# EAGLE design weatherMat (EAGLE 7.5.0)
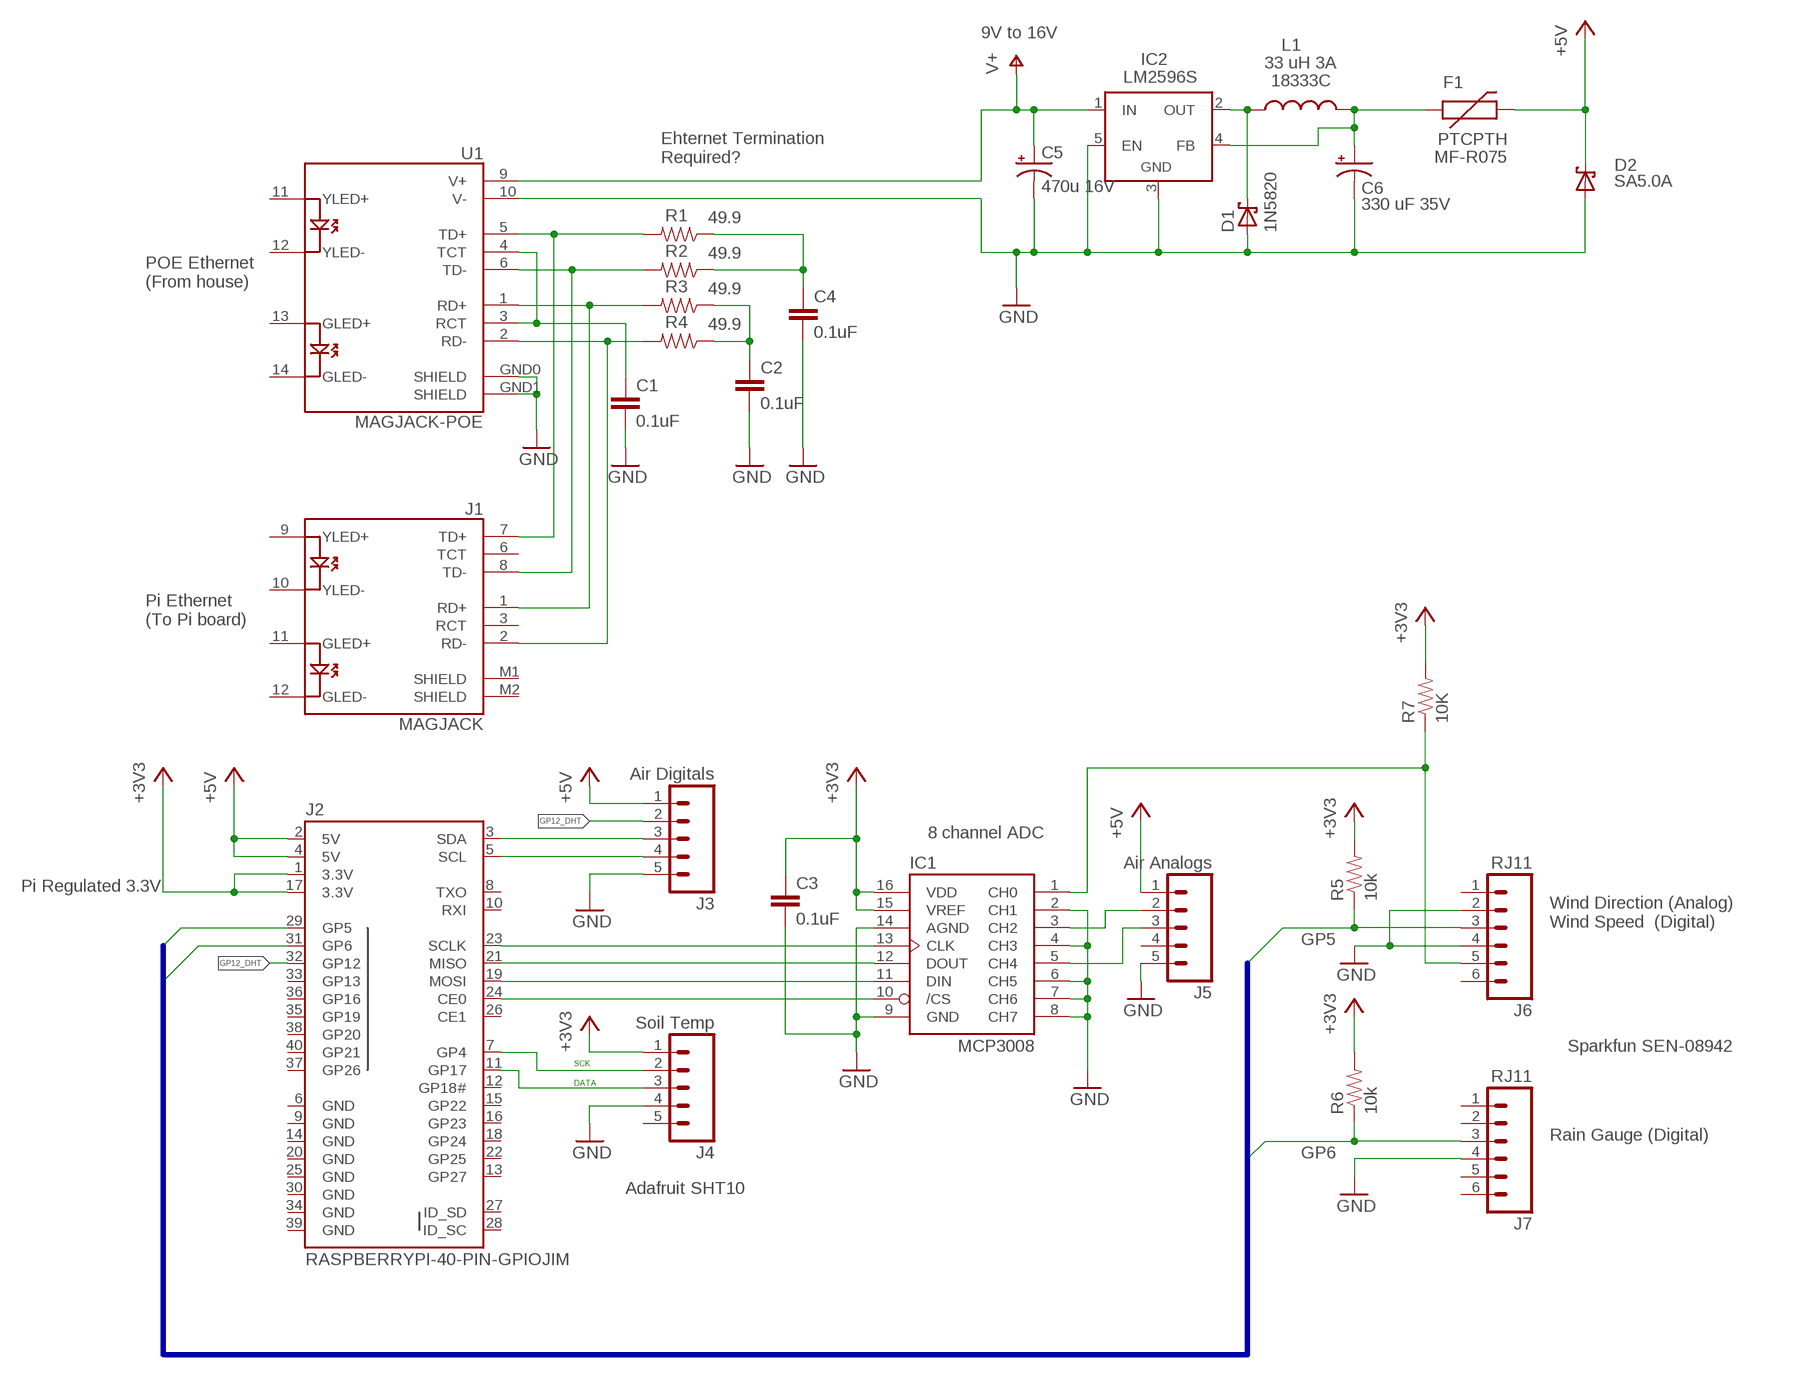
[diagram p0: schematic, sheet 1]

## Parts
C1  0.1uF  CAPPTH  [CAP-PTH-SMALL]
C2  0.1uF  CAPPTH  [CAP-PTH-SMALL]
C3  0.1uF  CAPPTH  [CAP-PTH-SMALL]
C4  0.1uF  CAPPTH  [CAP-PTH-SMALL]
C5  470u 16V  CAP_POL  [CPOL-RADIAL-470UF-16V]
C6  330 uF 35V  CAP_POLTEST  [CPOL-RADIAL-100UF-25V]
D1  1N5820  SCHOTTKY-DIODEDO201T15  [DO201T15]
D2  SA5.0A  [DO15-12]
F1  PTCPTH  [PTC]
IC1  MCP3008  [DIL16]
IC2  LM2596S  LM2596TV  [TO220-51]
J1  MAGJACK  [MAGJACK]
J2  RASPBERRYPI-40-PIN-GPIOJIM  [2X20-JIM]
J3  Air Digitals  M05SCREW  [SCREWTERMINAL-3.5MM-5]
J4  Soil Temp  M05SCREW  [SCREWTERMINAL-3.5MM-5]
J5  Air Analogs  M05SCREW  [SCREWTERMINAL-3.5MM-5]
J6  RJ11  RJ11-6PTH  [RJ11-6]
J7  RJ11  RJ11-6PTH  [RJ11-6]
L1  33 uH 3A  INDUCTORMUR  [MURATA]
R1  49.9  RESISTORPTH-1/4W  [AXIAL-0.4]
R2  49.9  RESISTORPTH-1/4W  [AXIAL-0.4]
R3  49.9  RESISTORPTH-1/4W  [AXIAL-0.4]
R4  49.9  RESISTORPTH-1/4W  [AXIAL-0.4]
R5  10k  RESISTORPTH-1/4W  [AXIAL-0.4]
R6  10k  RESISTORPTH-1/4W  [AXIAL-0.4]
R7  10K  RESISTORPTH-1/4W  [AXIAL-0.4]
U1  MAGJACK-POE  [MAGJACK-POE]

## Nets
+3V3 [power]: C3.1 IC1.15(VREF) IC1.16(VDD) J2.1(3.3V) J2.17(3.3V) J4.1 R5.P$2 R6.P$2 R7.P$2
+5V [power]: D2.C F1.P$2 J2.2(5V) J2.4(5V) J3.1 J5.1
GND [power]: C1.2 C2.2 C3.2 C4.2 C5.2(-) C6.2(-) D1.A D2.A IC1.2(CH1) IC1.4(CH3) IC1.6(CH5) IC1.7(CH6) IC1.8(CH7) IC1.9(GND) IC1.14(AGND) IC2.3(GND) IC2.5(EN) J3.5 J4.4 J5.5 J6.2 J6.4 J7.4 U1.10(V-) U1.GND0(SHIELD) U1.GND1(SHIELD)
GP5: J2.29(GP5) J6.3 R5.P$1
GP6: J2.31(GP6) J7.3 R6.P$1
GP12_DHT: J2.32(GP12) J3.2
N$1 [power]: D1.C IC2.2(OUT) L1.P$1
N$2: C1.1 U1.3(RCT) U1.4(TCT)
N$3: J1.7(TD+) R1.P$2 U1.5(TD+)
N$4: J1.8(TD-) R2.P$2 U1.6(TD-)
N$5: J1.1(RD+) R3.P$2 U1.1(RD+)
N$6: J1.2(RD-) R4.P$2 U1.2(RD-)
N$7: C4.1 R1.P$1 R2.P$1
N$8: C2.1 R3.P$1 R4.P$1
N$9: IC1.12(DOUT) J2.21(MISO)
N$10: IC1.11(DIN) J2.19(MOSI)
N$11: IC1.13(CLK) J2.23(SCLK)
N$12: IC1.10(/CS) J2.24(CE0)
N$13: IC1.1(CH0) J6.5 R7.P$1
N$14 [power]: C6.1(+) F1.P$1 IC2.4(FB) L1.P$3
N$15: J2.3(SDA) J3.3
N$16: J2.5(SCL) J3.4
N$17: IC1.3(CH2) J5.2
N$18: IC1.5(CH4) J5.3
N$20: J2.11(GP17) J4.3
N$21: J2.7(GP4) J4.2
V+ [power]: C5.1(+) IC2.1(IN) U1.9(V+)
Unconnected: J1.3(RCT) J1.6(TCT) J1.9(YLED+) J1.10(YLED-) J1.11(GLED+) J1.12(GLED-) J1.M1(SHIELD) J1.M2(SHIELD) J2.8(TXO) J2.10(RXI) J2.12(GP18#) J2.13(GP27) J2.15(GP22) J2.16(GP23) J2.18(GP24) J2.22(GP25) J2.26(CE1) J2.27(ID_SD) J2.28(ID_SC) J2.33(GP13) J2.35(GP19) J2.36(GP16) J2.37(GP26) J2.38(GP20) J2.40(GP21) J4.5 J5.4 J6.1 J6.6 J7.1 J7.2 J7.5 J7.6 U1.11(YLED+) U1.12(YLED-) U1.13(GLED+) U1.14(GLED-)

## Buses
GPBUS:GP5,GP6

## Notes on the sheet
- 9V to 16V
- Ehternet Termination
  Required?
- POE Ethernet
  (From house)
- Pi Ethernet
  (To Pi board)
- 8 channel ADC
- Pi Regulated 3.3V
- Wind Direction (Analog)
  Wind Speed  (Digital)
- Sparkfun SEN-08942
- SCK
- DATA
- Rain Gauge (Digital)
- Adafruit SHT10

## Power pins joined to a net without a drawn wire
GND: J2.6(GND) J2.9(GND) J2.14(GND) J2.20(GND) J2.25(GND) J2.30(GND) J2.34(GND) J2.39(GND)

## Library data of the parts
C1-C4 = SparkFun-Capacitors:CAP: Capacitor Standard 0603 ceramic capacitor, and 0.1" leaded capacitor.
C5 C6 = SparkFun-Capacitors:CAP_POL: Capacitor Polarized These are standard SMD and PTH capacitors. Normally 10uF, 47uF, and 100uF in electrolytic and tantalum varieties. Always verify the external diameter of the through hole cap, it varies with capacity, voltage, and manufacturer. The EIA devices should be standard.
D1 = adafruit:SCHOTTKY-DIODE: Schottky Diode
D2 = diode:SA5.0A: DIODE transient voltage suppressor
F1 = SparkFun-PowerIC:PTC: Resettable Fuse PTC Resettable Fuse. Spark Fun Electronics SKU : COM-08357; PARTNUM: MF-R075
IC1 = adafruit:MCP3008
IC2 = linear:LM2596T: STEP-DOWN VOLTAGE REGULATOR
J1 = SparkFun-Connectors:MAGJACK: RJ-45 with LEDs
J2 = SparkFun-Boards:RASPBERRYPI-40-PIN-GPIO: Second Generation Raspberry Pi GPIO Header 2x20 pin connector, as found on B, B+, A+ models.
J3-J5 = SparkFun-Connectors:M05: Header 5 Standard 5-pin 0.1" header. Use with straight break away headers (SKU : PRT-00116), right angle break away headers (PRT-00553), swiss pins (PRT-00743), machine pins (PRT-00117), and female headers (PRT-00115). Molex polarized connector foot print use with SKU : PRT-08230 with associated crimp pins and housings.; PROD_ID: Combine 8288+8399
J6 J7 = SparkFun-Connectors:RJ11-6: RJ11 Jack Simple 6 pin RJ11 jack. Commonly found on CAT3 devices and Microchip programmers. SKU: PRT-00132; PROD_ID: CONN-08590
L1 = SparkFun-Passives:INDUCTOR: Inductors Basic Inductor/Choke - 0603 and 1206. Footprints are not proven and vary greatly between part numbers. INDUCTOR POWER 3.3UH 4.0A SMD 0.197" L x 0.197" W x 0.177" H (5.00mm x 5.00mm x 4.50mm); PARTNUM: 18333C
R1-R7 = SparkFun-Passives:RESISTOR: Resistor Basic schematic elements and footprints for 0603, 1206, and PTH resistors.
U1 = SparkFun-Connectors:MAGJACK-POE: PoE compatible MagJack

## Net classes
0 default: width 0.305 mm, clearance 0.205 mm
1 power: width 1.016 mm, clearance 0.205 mm

## Board
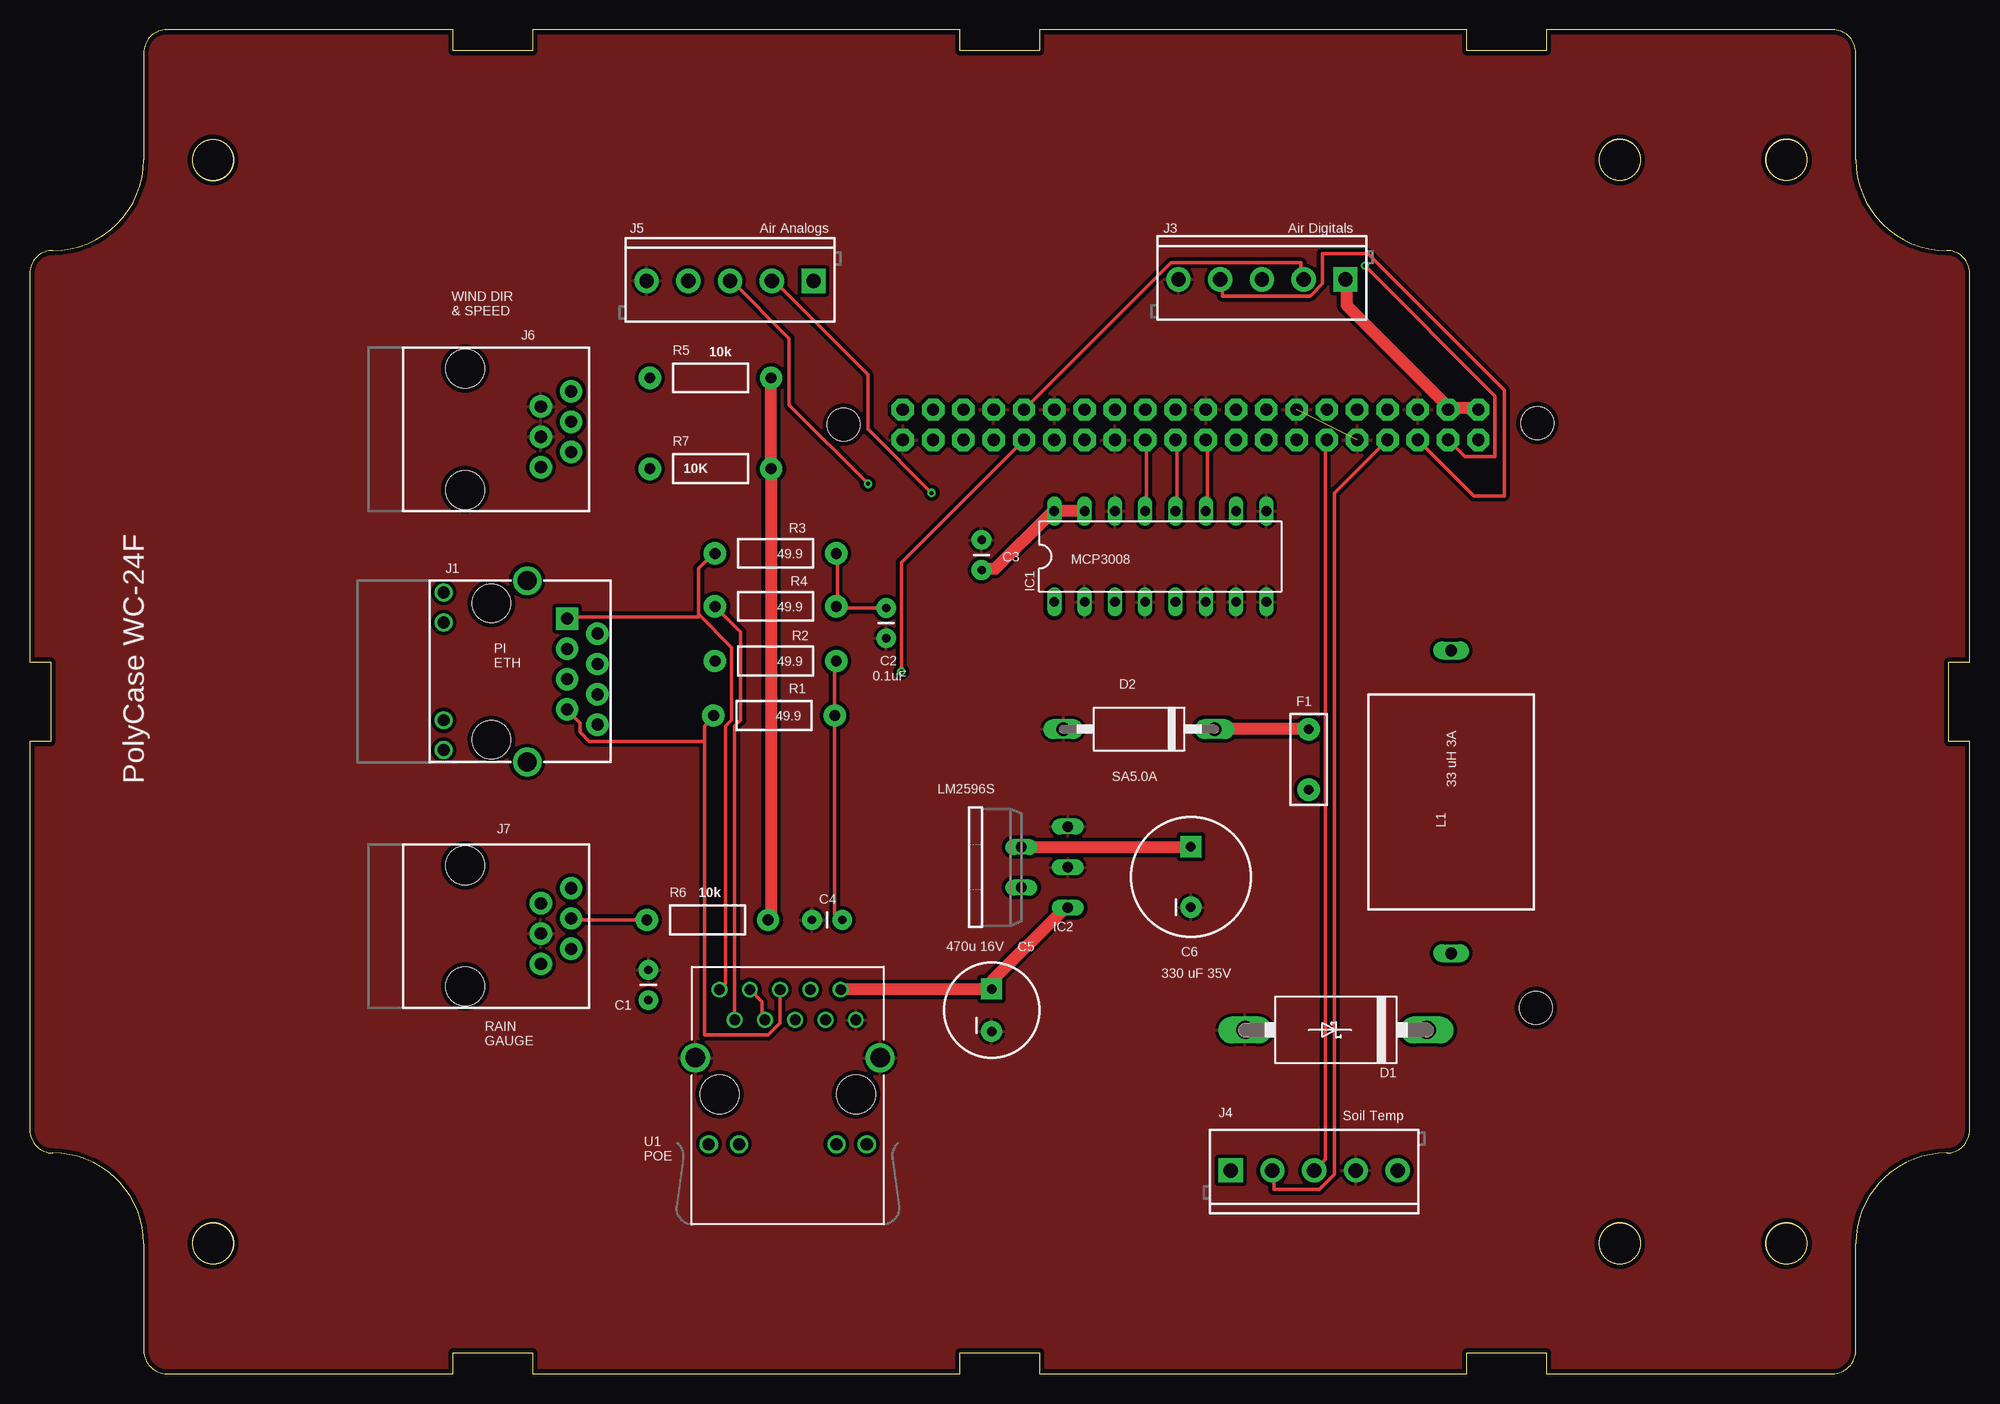
[diagram p1: board, top side]
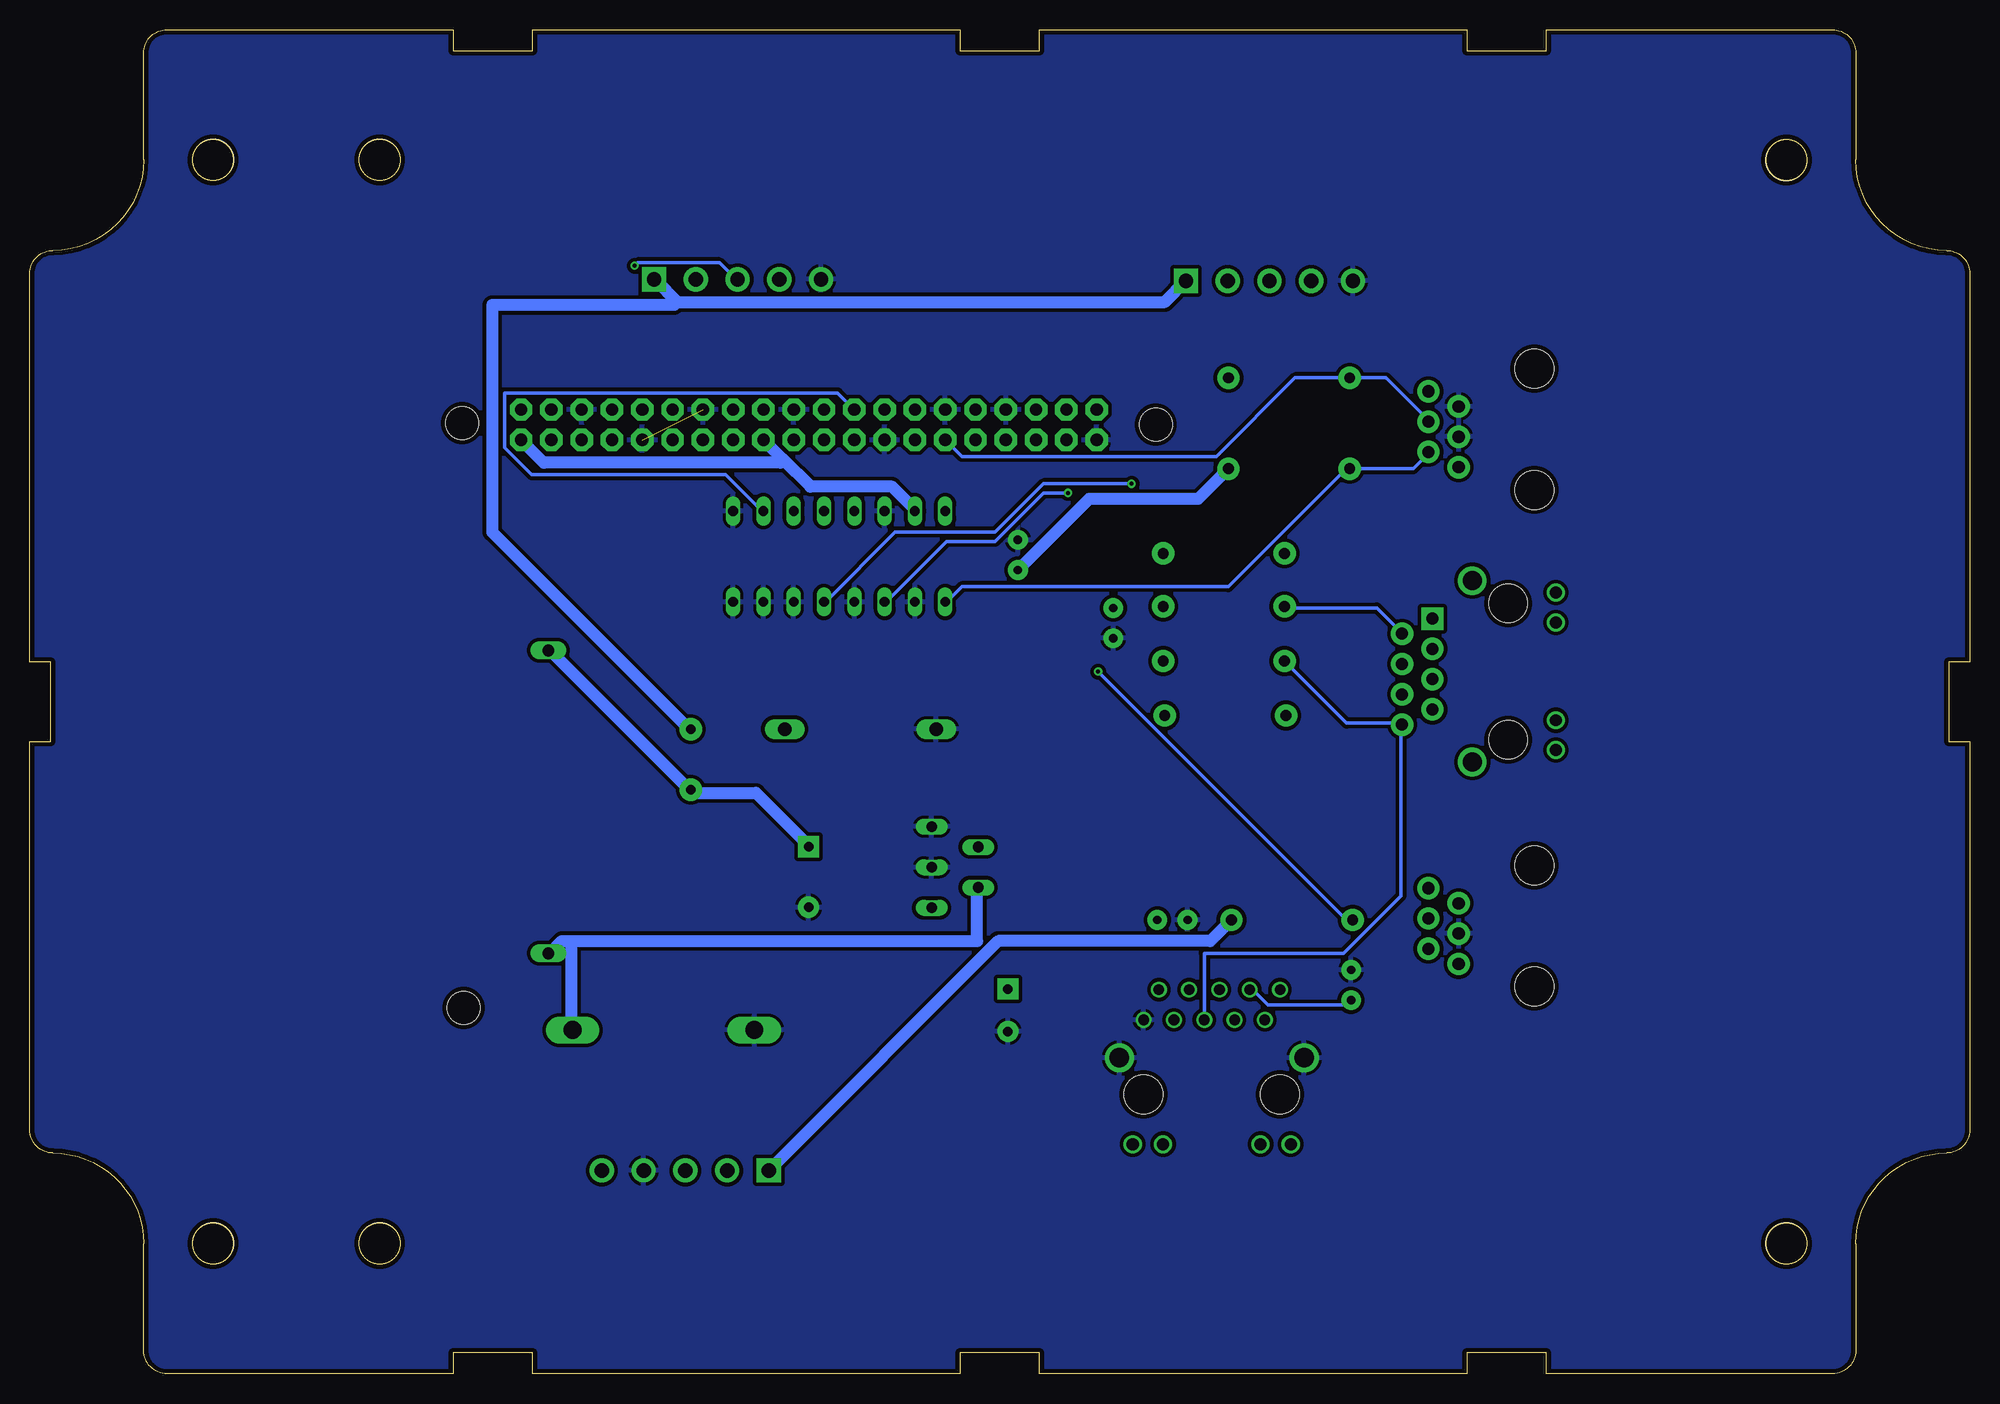
[diagram p2: board, bottom side, seen from below]

Size 162.66 x 112.7 mm. Coordinates in mm from the lower left corner, seen from the top.
Copper layers (1*16): Top 0.0356mm / dielectric 1.5011mm / Bottom 0.0356mm
Design rules "LaenPCBOrder": minimum track width 6mil, minimum drill 13mil, track to track 6mil, track to pad 6mil, pad to pad 6mil, via to via 6mil, smd to smd 6mil, copper to edge 15mil, drill to drill 6mil, minimum pad ring 7mil, minimum via ring 7mil, stop-mask expansion 3mil, vias tented up to drill 0mil, thermal gap 10mil
Holes 2.75 mm at 126.42,79.71 126.29,30.68 68.25,79.58
Holes 3.43 mm at 133.32,101.8 147.29,101.8 147.29,10.92 133.32,10.92 15.37,10.92 15.37,101.78

### Footprints (pad centres in the part's own frame; a part is rotated, then mirrored left to right if it is on the bottom)
CAP-PTH-SMALL = drill 0.7 pad 1.651: 1 0,0; 2 2.54,0
CPOL-RADIAL-470UF-16V = drill 0.8 pad 1.778 square: 1 1.778,0 | drill 0.8 pad 1.778: 2 -1.778,0
CPOL-RADIAL-100UF-25V = drill 0.8 pad 1.778 square: 1 2.54,0 | drill 0.8 pad 1.778: 2 -2.54,0
DO201T15 = drill 1.499 long: A 7.62,0; C -7.62,0
DO15-12 = drill 1.118 long: A 6.35,0; C -6.35,0
PTC = drill 0.8 pad 1.88: P$1 -2.54,0; P$2 2.54,0
DIL16 = drill 0.813 long: 1 -8.89,-3.81; 2 -6.35,-3.81; 3 -3.81,-3.81; 4 -1.27,-3.81; 5 1.27,-3.81; 6 3.81,-3.81; 7 6.35,-3.81; 8 8.89,-3.81; 9 8.89,3.81; 10 6.35,3.81; 11 3.81,3.81; 12 1.27,3.81; 13 -1.27,3.81; 14 -3.81,3.81; 15 -6.35,3.81; 16 -8.89,3.81
TO220-51 = drill 0.9 long: 1 -3.4,-8.4; 2 -1.7,-4.5; 3 0,-8.4; 4 1.7,-4.5; 5 3.4,-8.4
MAGJACK = drill 1 pad 1.88 square: 1 3.175,17.445 | drill 1 pad 1.88: 2 4.445,19.985; 3 5.715,17.445; 4 6.985,19.985; 5 8.255,17.445; 6 9.525,19.985; 7 10.795,17.445; 8 12.065,19.985 | drill 1 pad 1.27: 9 1,7.1; 10 3.5,7.1; 11 11.7,7.1; 12 14.2,7.1 | drill 1.6 pad 2.184: M1 0,14.1; M2 15.2,14.1 | hole 3.2: 1.905,11.095; 13.335,11.095
2X20-JIM = drill 1.016 pad 1.88 octagon: 1 -1.27,24.13; 2 1.27,24.13; 3 -1.27,21.59; 4 1.27,21.59; 5 -1.27,19.05; 6 1.27,19.05; 7 -1.27,16.51; 8 1.27,16.51; 9 -1.27,13.97; 10 1.27,13.97; 11 -1.27,11.43; 12 1.27,11.43; 13 -1.27,8.89; 14 1.27,8.89; 15 -1.27,6.35; 16 1.27,6.35; 17 -1.27,3.81; 18 1.27,3.81; 19 -1.27,1.27; 20 1.27,1.27; 21 -1.27,-1.27; 22 1.27,-1.27; 23 -1.27,-3.81; 24 1.27,-3.81; 25 -1.27,-6.35; 26 1.27,-6.35; 27 -1.27,-8.89; 28 1.27,-8.89; 29 -1.27,-11.43; 30 1.27,-11.43; 31 -1.27,-13.97; 32 1.27,-13.97; 33 -1.27,-16.51; 34 1.27,-16.51; 35 -1.27,-19.05; 36 1.27,-19.05; 37 -1.27,-21.59; 38 1.27,-21.59; 39 -1.27,-24.13; 40 1.27,-24.13
SCREWTERMINAL-3.5MM-5 = drill 1.2 pad 2.032 square: 1 0,0 | drill 1.2 pad 2.032: 2 3.5,0; 3 7,0; 4 10.5,0; 5 14,0
RJ11-6 = drill 1.016 pad 1.88: 1 -3.175,8.89; 2 -1.905,6.35; 3 -0.635,8.89; 4 0.635,6.35; 5 1.905,8.89; 6 3.175,6.35 | hole 3.251: -5.08,0; 5.08,0
MURATA = drill 1 long: P$1 12.7,0; P$3 -12.7,0
AXIAL-0.4 = drill 0.9 pad 1.88: P$1 -5.08,0; P$2 5.08,0
MAGJACK-POE = drill 0.89: 1 5.72,-8.89; 2 4.45,-6.35; 3 3.18,-8.89; 4 1.91,-6.35; 5 0.64,-8.89; 6 -0.63,-6.35; 7 -1.9,-8.89; 8 -3.17,-6.35; 9 -4.44,-8.89; 10 -5.71,-6.35 | drill 1.02: 11 6.625,4.08; 12 4.085,4.08; 13 -4.085,4.08; 14 -6.625,4.08 | drill 1.63: GND0 -7.745,-3.17; GND1 7.745,-3.17 | hole 3.25: -5.715,-0.12; 5.715,-0.12

### Placement (x,y rotation side)
C1  51.87,31.32 90 top
C2  71.81,64.21 270 top
C3  79.81,67.39 90 top
C4  68.12,38.05 180 top
C5  80.64,30.48 90 top
C6  97.36,41.66 90 top
D1  109.52,28.83 180 top
D2  93.01,54.05 180 top
F1  107.24,51.51 90 top
IC1  94.79,68.53 0 top
IC2  78.64,42.47 90 top
J1  27.61,66.5 270 top
J2  97.33,79.58 90 bottom
J3  110.31,91.77 180 top
J4  100.69,17.04 0 top
J5  65.71,91.64 180 top
J6  36.5,79.2 270 top
J7  36.5,37.54 270 top
L1  119.18,47.96 270 top
R1  62.41,55.2 180 top
R2  62.53,59.77 180 top
R3  62.53,68.78 180 top
R4  62.53,64.34 180 top
R5  57.07,83.52 0 top
R6  56.82,38.05 0 top
R7  57.07,75.9 0 top
U1  63.55,23.32 180 top
U$2  [WC-24F]  -0.2,0.46 0 top

### Tracks (layer width: path | path; a pad name or v marks a point on that pad's centre or on a via)
+3V3
  Top 1.016: IC1.15 IC1.16 85.52,72.09 80.95,67.51 79.93,67.51 C3.1 | R6.P$2 62.15,38.3 R7.P$2 R5.P$2
  Bottom 1.016: 99.49,76.66 97.21,74.37 90.35,74.37 88.32,72.34 IC1.15 | 99.49,76.66 J2.17 | J2.1 119.56,76.4 99.75,76.4 99.49,76.66 | J4.1 81.46,36.27 63.68,36.27 R6.P$2 | C3.1 73.84,73.36 64.69,73.36 R7.P$2
+5V
  Top 1.016: F1.P$2 D2.C | J2.2 121.34,80.98 119.05,80.98 J2.4 118.8,81.23 110.41,89.61 110.41,91.64 J3.1
  Bottom 1.016: J5.1 67.49,89.87 108.38,89.87 | 108.38,89.87 110.16,91.64 J3.1 | F1.P$2 107.37,54.05 123.88,70.56 123.88,89.61 108.64,89.61 108.38,89.87
GND  (1 unrouted)
  pour Bottom (isolate 0.305): -0.58,-0.05 -0.58,112.98 163.25,114.25 163.25,-0.05
  pour Top (isolate 0.305): -0.58,-0.05 -0.58,112.98 163.25,112.98 163.25,-0.05
GP5
  Bottom 0.305: J6.3 45.39,79.96 48.95,83.52 R5.P$1 56.57,83.52 63.17,76.91 84.51,76.91 J2.29
GP6  (via drill 0.33)
  Top 0.305: R6.P$1 45.39,38.05 J7.3 | J2.31 73.08,68.02 v73.08,58.88
  Bottom 0.305: v73.08,58.88 52.25,38.05 R6.P$1
GP12_DHT
  Top 0.305: J2.32 95.68,93.17 106.6,93.17 106.6,91.9 J3.2
N$1
  Bottom 1.016: 117.27,36.27 118.03,36.27 119.05,35.26 L1.P$1 | 117.27,36.27 83.24,36.27 83.24,40.59 IC2.2 | 117.27,36.27 117.27,28.91 D1.C
N$2
  Top 0.305: U1.3 61.39,31.19 61.39,29.67 U1.4
  Bottom 0.305: C1.1 52.25,30.94 58.85,30.94 60.12,32.21 U1.3
N$3
  Top 0.305: 56.57,53.04 56.57,54.31 57.33,55.07 R1.P$2 | 56.57,53.04 56.57,28.4 61.9,28.4 62.92,29.41 U1.5 | 56.57,53.04 46.91,53.04 46.15,53.8 46.15,54.56 45.14,55.58 J1.7
N$4
  Bottom 0.305: U1.6 64.19,35.26 52.5,35.26 47.68,40.08 47.68,54.31 J1.8 47.68,54.56 52.25,54.56 R2.P$2
N$5
  Top 0.305: 56.06,63.7 58.85,60.91 58.85,54.81 58.34,54.31 58.34,32.72 U1.1 | 56.06,63.7 56.06,67.51 57.33,68.78 R3.P$2 | 56.06,63.7 56.06,63.45 45.14,63.45 J1.1
N$6
  Top 0.305: R4.P$2 59.61,62.18 59.61,54.81 59.11,54.31 U1.2
  Bottom 0.305: J1.2 47.68,62.18 49.71,64.21 57.33,64.21 R4.P$2
N$7
  Top 0.305: C4.1 68,38.05 67.49,38.56 R1.P$1 67.49,59.64 R2.P$1
N$8
  Top 0.305: C2.1 67.74,64.21 R4.P$1 67.74,64.47 67.74,68.78 R3.P$1
N$9
  Top 0.305: IC1.12 96.19,72.34 96.19,78.18 J2.21
N$10
  Top 0.305: IC1.11 98.73,72.34 98.73,78.18 J2.19
N$11
  Top 0.305: IC1.13 93.65,72.34 93.65,78.18 J2.23
N$12
  Bottom 0.305: J2.24 94.92,82.25 122.86,82.25 122.86,77.67 120.57,75.39 104.32,75.39 101.27,72.34 IC1.10
N$13
  Bottom 0.305: IC1.1 85.78,64.72 84.51,65.99 62.15,65.99 52.25,75.9 R7.P$1 46.66,75.9 45.39,77.17 J6.5
N$14
  Top 1.016: IC2.4 83.24,44.15 97.21,44.15 C6.1
  Bottom 1.016: L1.P$3 119.05,60.66 107.37,48.97 F1.P$1 106.86,48.72 101.78,48.72 97.46,44.4 C6.1
N$15  (via drill 0.33)
  Top 0.305: J2.3 120.32,76.91 122.86,76.91 122.86,81.99 v111.94,92.91
  Bottom 0.305: v111.94,92.91 111.68,93.17 104.83,93.17 103.56,91.9 J3.3
N$16
  Top 0.305: J2.5 121.08,73.61 123.62,73.61 123.62,82.5 112.19,93.93 108.38,93.93 108.38,91.39 107.37,90.37 100,90.37 100,91.64 J3.4
N$17  (via drill 0.33)
  Top 0.305: v75.62,73.86 70.28,79.2 70.28,83.77 62.41,91.64 J5.2
  Bottom 0.305: v75.62,73.86 77.65,73.86 81.71,69.8 85.78,69.8 90.86,64.72 IC1.3
N$18  (via drill 0.33)
  Top 0.305: v70.28,74.63 63.68,81.23 63.68,86.82 58.85,91.64 J5.3
  Bottom 0.305: v70.28,74.63 77.65,74.63 81.71,70.56 90.09,70.56 95.94,64.72 IC1.5
N$20
  Top 0.305: J2.11 108.64,78.18 108.64,17.98 107.87,17.22 J4.3
N$21
  Top 0.305: J2.7 109.4,73.86 109.4,16.71 108.13,15.44 104.32,15.44 104.32,16.97 J4.2
V+
  Top 1.016: U1.9 80.44,32.21 C5.1 80.7,32.72 80.7,32.97 86.79,39.07 IC2.1

### Text on the board
tPlace: WIND DIR / & SPEED | J1 | PI / ETH | PolyCase WC-24F | RAIN / GAUGE | U1 / POE